# EAGLE schematic Eagle_Dued (EAGLE 6.4)
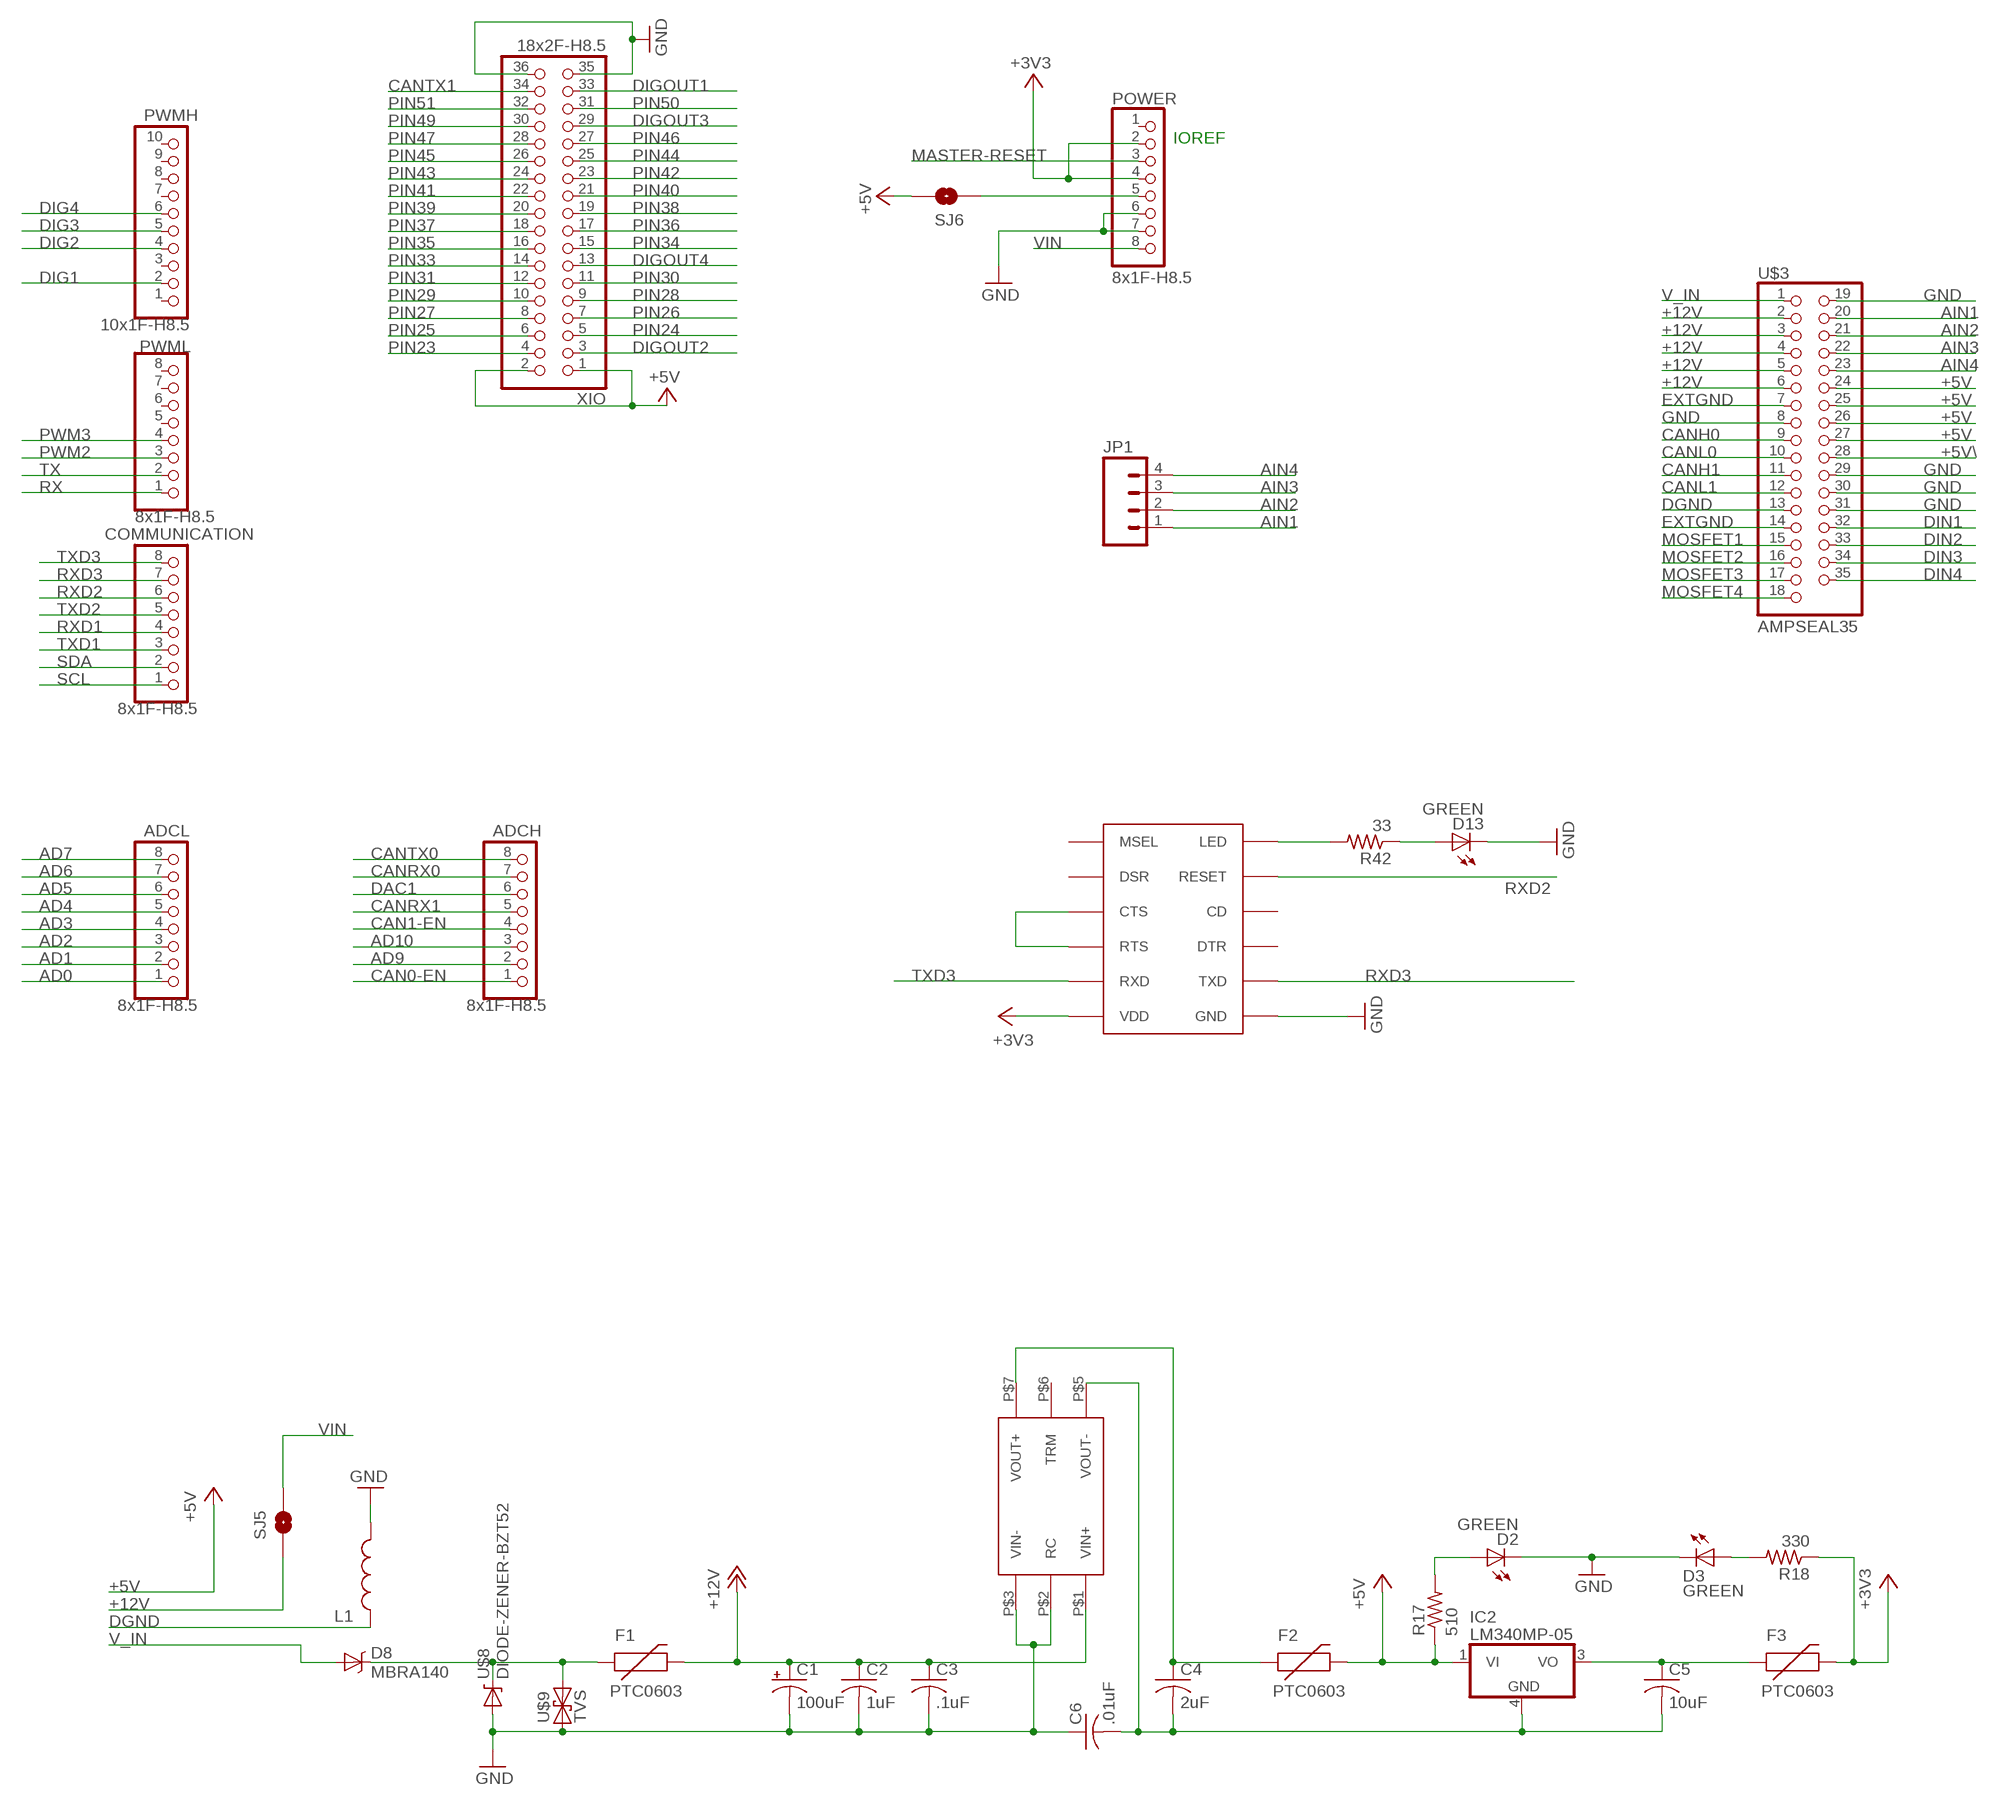
[diagram p0: schematic, sheet 1, part 1 of 2]
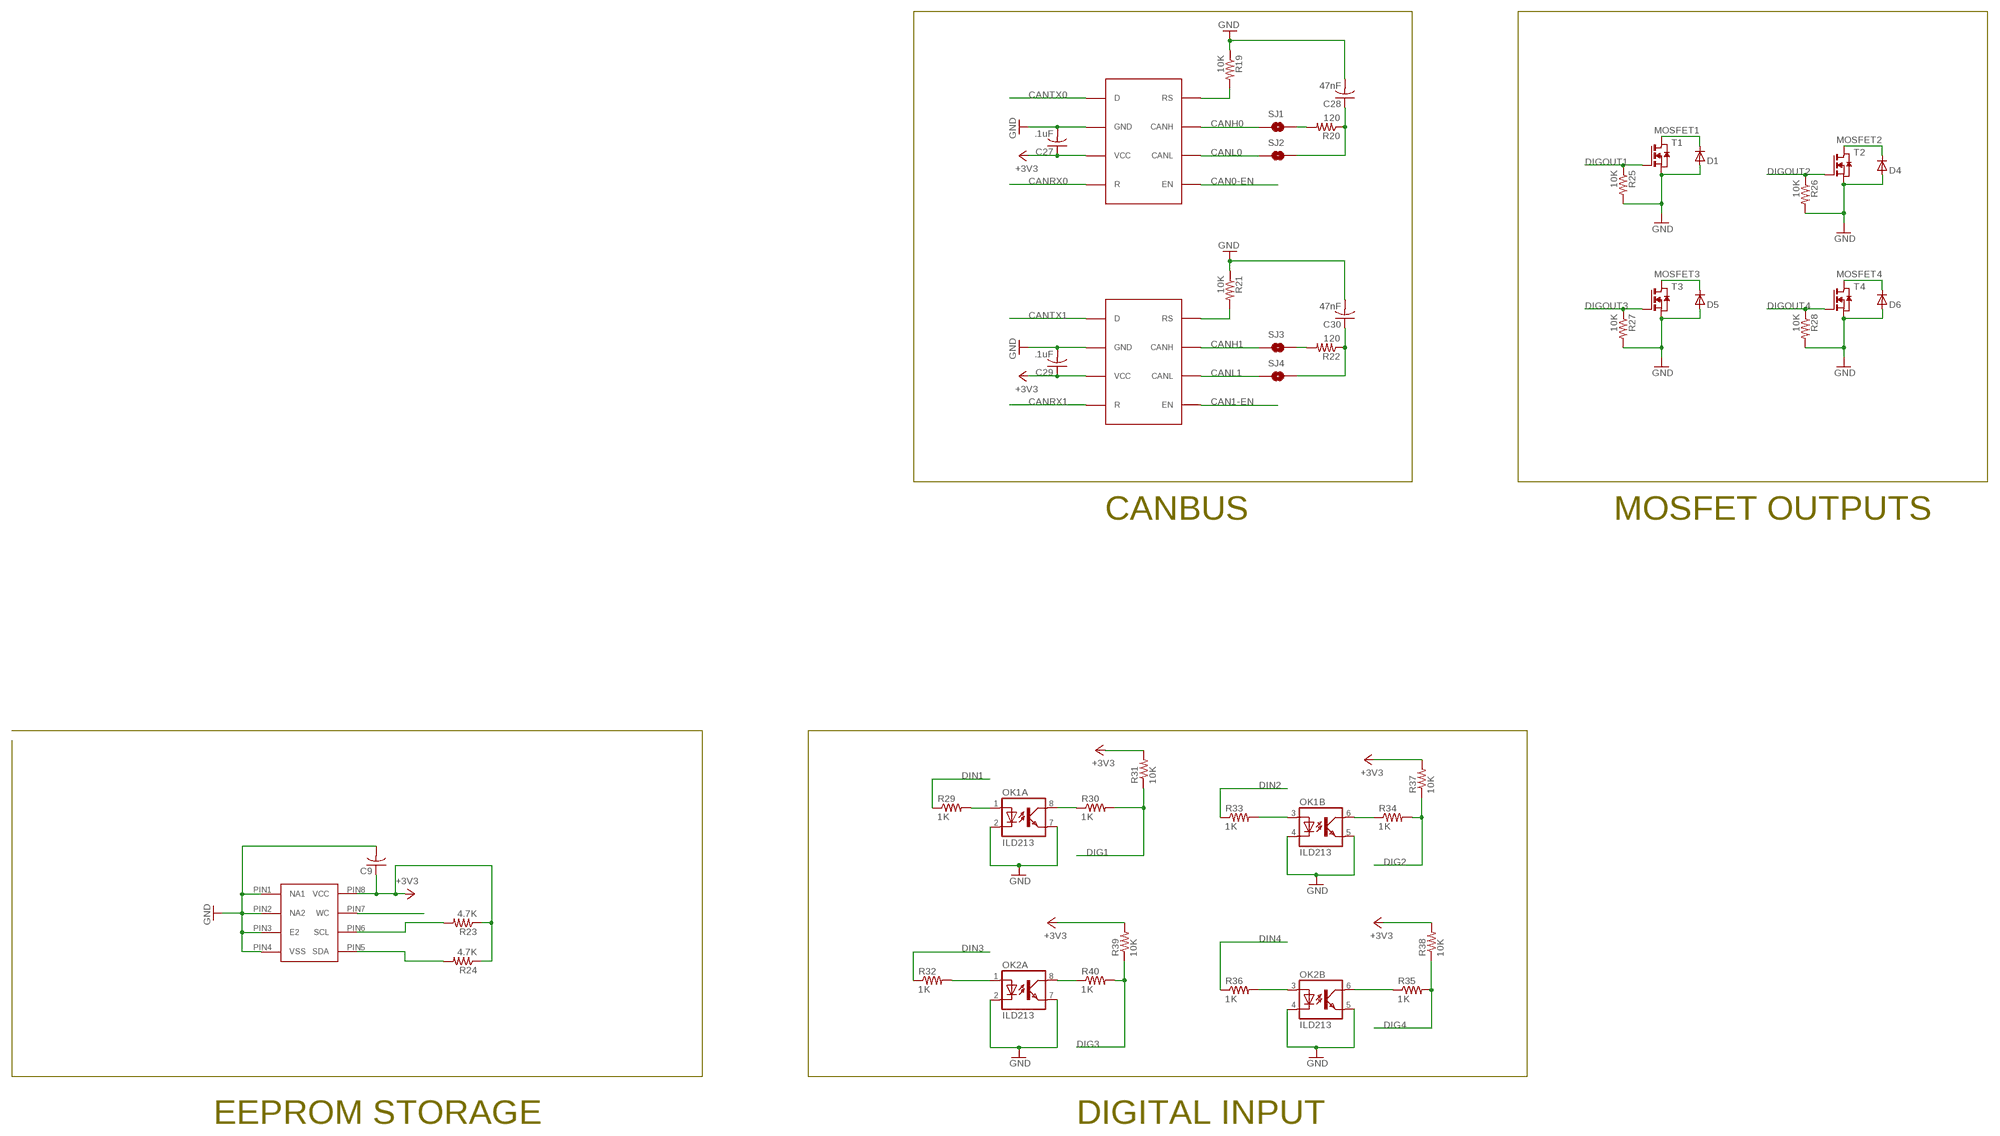
[diagram p1: schematic, sheet 1, part 2 of 2]

## Parts
ADCH  8x1F-H8.5  PINHD-1X8  [1X08]
ADCL  8x1F-H8.5  PINHD-1X8  [1X08]
C1  100uF  CPOL-USE2.5-6  [E2,5-6]
C2  1uF  C-USC1206  [C1206]
C3  .1uF  C-USC1206  [C1206]
C4  2uF  C-USC0805  [C0805]
C5  10uF  C-USC1206  [C1206]
C6  .01uF  C-USC1206  [C1206]
C9  C-USC0603  [C0603]
C27  .1uF  C-USC0603  [C0603]
C28  47nF  C-USC0603  [C0603]
C29  .1uF  C-USC0603  [C0603]
C30  47nF  C-USC0603  [C0603]
COMMUNICATION  8x1F-H8.5  PINHD-1X8  [1X08]
D1  MBR0520LT  [SOD123]
D2  GREEN  LED-GREEN0603  [LED-0603]
D3  GREEN  LED-GREEN0603  [LED-0603]
D4  MBR0520LT  [SOD123]
D5  MBR0520LT  [SOD123]
D6  MBR0520LT  [SOD123]
D8  MBRA140  [SMA-DIODE]
D13  GREEN  LED-GREEN0603  [LED-0603]
F1  PTC0603  [0603]
F2  PTC0603  [0603]
F3  PTC0603  [0603]
IC2  LM340MP-05  [SOT223]
JP1  M04POLAR  [MOLEX-1X4]
L1  INDUCTOR1206H*  [INDUCTOR-1206]
OK1  ILD213  [SOIC08]
OK2  ILD213  [SOIC08]
POWER  8x1F-H8.5  PINHD-1X8  [1X08]
PWMH  10x1F-H8.5  PINHD-1X10  [1X10]
PWML  8x1F-H8.5  PINHD-1X8  [1X08]
R17  510  R-US_R0603  [R0603]
R18  330  R-US_R0603  [R0603]
R19  10K  R-US_R0603  [R0603]
R20  120  R-US_R0603  [R0603]
R21  10K  R-US_R0603  [R0603]
R22  120  R-US_R0603  [R0603]
R23  4.7K  R-US_R0603  [R0603]
R24  4.7K  R-US_R0603  [R0603]
R25  10K  R-US_R0603  [R0603]
R26  10K  R-US_R0603  [R0603]
R27  10K  R-US_R0603  [R0603]
R28  10K  R-US_R0603  [R0603]
R29  1K  R-US_R0603  [R0603]
R30  1K  R-US_R0603  [R0603]
R31  10K  R-US_R0603  [R0603]
R32  1K  R-US_R0603  [R0603]
R33  1K  R-US_R0603  [R0603]
R34  1K  R-US_R0603  [R0603]
R35  1K  R-US_R0603  [R0603]
R36  1K  R-US_R0603  [R0603]
R37  10K  R-US_R0603  [R0603]
R38  10K  R-US_R0603  [R0603]
R39  10K  R-US_R0603  [R0603]
R40  1K  R-US_R0603  [R0603]
R42  33  R-US_R0603  [R0603]
SJ1  SOLDERJUMPERNO  [SJ_2S-NO]
SJ2  SOLDERJUMPERNO  [SJ_2S-NO]
SJ3  SOLDERJUMPERNO  [SJ_2S-NO]
SJ4  SOLDERJUMPERNO  [SJ_2S-NO]
SJ5  SOLDERJUMPERNO  [SJ_2S-NO]
SJ6  SOLDERJUMPERNO  [SJ_2S-NO]
T1  NMOSSOT223  [SOT223]
T2  NMOSSOT223  [SOT223]
T3  NMOSSOT223  [SOT223]
T4  NMOSSOT223  [SOT223]
U$1  CC3-E  [CC3-E]
U$2  SN65HVD234  [SOIC8]
U$3  AMPSEAL35  [AMPSEAL35]
U$4  MINIWIFI  [MINIWIFI]
U$5  M24M02-DRMN6TP  [SOIC8]
U$6  SN65HVD234  [SOIC8]
U$8  DIODE-ZENER-BZT52  [SOD-323]
U$9  TVS  [SMA-DIODE]
XIO  18x2F-H8.5  PINHD-2X18  [2X18]

## Nets
+3V3: C9.1 C27.1 C29.1 F3.2 POWER.2 POWER.4 R18.1 R23.1 R24.1 R31.2 R37.2 R38.2 R39.2 U$2.PIN3(VCC) U$4.P$1(VDD) U$5.PIN8(VCC) U$6.PIN3(VCC)
+5V: F2.2 IC2.1(VI) R17.1 SJ6.2 U$3.24 U$3.25 U$3.26 U$3.27 XIO.1 XIO.2
+5V\: U$3.28
+12V: C1.+ C2.1 C3.1 F1.2 SJ5.1 U$1.P$1(VIN+) U$3.2 U$3.3 U$3.4 U$3.5 U$3.6
AD0: ADCL.1
AD1: ADCL.2
AD2: ADCL.3
AD3: ADCL.4
AD4: ADCL.5
AD5: ADCL.6
AD6: ADCL.7
AD7: ADCL.8
AD9: ADCH.2
AD10: ADCH.3
AIN1: JP1.1 U$3.20
AIN2: JP1.2 U$3.21
AIN3: JP1.3 U$3.22
AIN4: JP1.4 U$3.23
CAN0-EN: ADCH.1 U$6.PIN5(EN)
CAN1-EN: ADCH.4 U$2.PIN5(EN)
CANH0: SJ1.1 U$3.9 U$6.PIN7(CANH)
CANH1: SJ3.1 U$2.PIN7(CANH) U$3.11
CANL0: SJ2.1 U$3.10 U$6.PIN6(CANL)
CANL1: SJ4.1 U$2.PIN6(CANL) U$3.12
CANRX0: ADCH.7 U$6.PIN4(R)
CANRX1: ADCH.5 U$2.PIN4(R)
CANTX0: ADCH.8 U$6.PIN1(D)
CANTX1: U$2.PIN1(D) XIO.34
DAC1: ADCH.6
DGND: L1.P$1 U$3.13
DIG1: PWMH.2 R30.2 R31.1
DIG2: PWMH.4 R34.2 R37.1
DIG3: PWMH.5 R39.1 R40.2
DIG4: PWMH.6 R35.2 R38.1
DIGOUT1: R25.1 T1.1(G) XIO.33
DIGOUT2: R26.1 T2.1(G) XIO.3
DIGOUT3: R27.1 T3.1(G) XIO.29
DIGOUT4: R28.1 T4.1(G) XIO.13
DIN1: R29.1 U$3.32
DIN2: R33.1 U$3.33
DIN3: R32.1 U$3.34
DIN4: R36.1 U$3.35
EXTGND: C1.- C2.2 C3.2 C6.1 D1.A D4.A D5.A D6.A OK1.2(A:C) OK1.4(B:C) OK1.5(B:EMIT) OK1.7(A:EMIT) OK2.2(A:C) OK2.4(B:C) OK2.5(B:EMIT) OK2.7(A:EMIT) R25.2 R26.2 R27.2 R28.2 T1.3(S) T2.3(S) T3.3(S) T4.3(S) U$1.P$2(RC) U$1.P$3(VIN-) U$3.7 U$3.14 U$8.2(A) U$9.A ; supply symbol labelled GND
GND: C4.2 C5.2 C6.2 C9.2 C27.2 C28.2 C29.2 C30.2 D2.C D3.C D13.C IC2.4(GND) L1.P$2 POWER.6 POWER.7 R19.1 R21.1 U$1.P$5(VOUT-) U$2.PIN2(GND) U$3.8 U$3.19 U$3.29 U$3.30 U$3.31 U$4.P$2(GND) U$5.PIN1(NA1) U$5.PIN2(NA2) U$5.PIN3(E2) U$5.PIN4(VSS) U$6.PIN2(GND) XIO.35 XIO.36
MASTER-RESET: POWER.3
MOSFET1: D1.C T1.2(D) T1.4(D) U$3.15
MOSFET2: D4.C T2.2(D) T2.4(D) U$3.16
MOSFET3: D5.C T3.2(D) T3.4(D) U$3.17
MOSFET4: D6.C T4.2(D) T4.4(D) U$3.18
N$1: POWER.5 SJ6.1
N$2: U$4.P$5(RTS) U$4.P$7(CTS)
N$3: D8.C F1.1 U$8.1(C) U$9.C
N$4: R42.2 U$4.P$12(LED)
N$6: C4.1 F2.1 U$1.P$7(VOUT+)
N$8: C5.1 F3.1 IC2.3(VO)
N$9: D13.A R42.1
N$23: D2.A R17.2
N$24: R19.2 U$6.PIN8(RS)
N$25: D3.A R18.2
N$26: C28.1 R20.1 SJ2.2
N$27: R20.2 SJ1.2
N$28: R21.2 U$2.PIN8(RS)
N$29: C30.1 R22.1 SJ4.2
N$30: R22.2 SJ3.2
N$31: OK1.1(A:A) R29.2
N$32: OK1.3(B:A) R33.2
N$33: OK1.8(A:COL) R30.1
N$34: OK1.6(B:COL) R34.1
N$36: OK2.6(B:COL) R35.1
N$38: OK2.8(A:COL) R40.1
N$40: OK2.1(A:A) R32.2
N$43: OK2.3(B:A) R36.2
PIN23: XIO.4
PIN24: XIO.5
PIN25: XIO.6
PIN26: XIO.7
PIN27: XIO.8
PIN28: XIO.9
PIN29: XIO.10
PIN30: XIO.11
PIN31: XIO.12
PIN33: XIO.14
PIN34: XIO.15
PIN35: XIO.16
PIN36: XIO.17
PIN37: XIO.18
PIN38: XIO.19
PIN39: XIO.20
PIN40: XIO.21
PIN41: XIO.22
PIN42: XIO.23
PIN43: XIO.24
PIN44: XIO.25
PIN45: XIO.26
PIN46: XIO.27
PIN47: XIO.28
PIN49: XIO.30
PIN50: XIO.31
PIN51: XIO.32
PWM2: PWML.3
PWM3: PWML.4
RX: PWML.1
RXD1: COMMUNICATION.4 U$5.PIN7(WC)
RXD2: COMMUNICATION.6 U$4.P$10(RESET)
RXD3: COMMUNICATION.7 U$4.P$4(TXD)
SCL: COMMUNICATION.1 R23.2 U$5.PIN6(SCL)
SDA: COMMUNICATION.2 R24.2 U$5.PIN5(SDA)
TX: PWML.2
TXD1: COMMUNICATION.3
TXD2: COMMUNICATION.5
TXD3: COMMUNICATION.8 U$4.P$3(RXD)
V_IN: D8.A U$3.1
VIN: POWER.8 SJ5.2
Unconnected: POWER.1 PWMH.1 PWMH.3 PWMH.7 PWMH.8 PWMH.9 PWMH.10 PWML.5 PWML.6 PWML.7 PWML.8 U$1.P$6(TRM) U$4.P$6(DTR) U$4.P$8(CD) U$4.P$9(DSR) U$4.P$11(MSEL)

## Notes on the sheet
- IOREF
- CANBUS | MOSFET OUTPUTS
- EEPROM STORAGE | DIGITAL INPUT

## Library data of the parts
ADCH ADCL COMMUNICATION POWER PWML = SmartPrj:PINHD-1X8: PIN HEADER
C1 = rcl:CPOL-US: POLARIZED CAPACITOR, American symbol
C2-C6 C9 C27-C30 = rcl:C-US: CAPACITOR, American symbol
D1 D4-D6 = diode:MBR0520LT: SCHOTTKY BARRIER RECTIFIER Source: http://onsemi.com .. MBR0520LT1-D.pdf
D2 D3 D13 = SparkFun-LED:LED-GREEN: Various green LEDs 0603- DIO-00821 LARGE- DIO-00862 LILYPAD- DIO-09910; PROD_ID: DIO-00821
D8 = SparkFun-DiscreteSemi:MBRA140: 40V, 1A Schottky rectifier SMA/DO-214AC package DIO-08053; PROD_ID: DIO-08053
F1-F3 = SparkFun-PowerIC:PTC: Resettable Fuse PTC Resettable Fuse. Spark Fun Electronics SKU : COM-08357
IC2 = linear:LM340?-*: Positive VOLTAGE REGULATOR Source: http://cache.national.com/ds/LM/LM340.pdf
JP1 = SparkFun-Connectors:M04: Header 4 Standard 4-pin 0.1" header. Use with straight break away headers (SKU : PRT-00116), right angle break away headers (PRT-00553), swiss pins (PRT-00743), machine pins (PRT-00117), and female headers (PRT-00115). Molex polarized connector foot print use with SKU : PRT-08231 with associated crimp pins and housings. 1MM SMD Version SKU: PRT-10208
L1 = SparkFun-Passives:INDUCTOR: Inductors Basic Inductor/Choke - 0603 and 1206. Footprints are not proven and vary greatly between part numbers.
OK1 OK2 = optocoupler:ILD2*: Siemens ILD205/206/207/211/213/217 DUAL PHOTOTRANSISTOR SMALL OUTLINE SURFACE MOUNT OPTOCOUPLER Source: 153385-da-01-en-Optocoupler_ILD205-T.pdf; MF: VISHAY/TELEFUNKEN; MPN: ILD213T; OC_FARNELL: 1045451; OC_NEWARK: 20H8680
PWMH = SmartPrj:PINHD-1X10: PIN HEADER
R17-R40 R42 = rcl:R-US_: RESISTOR, American symbol
SJ1-SJ6 = SparkFun-Passives:SOLDERJUMPER: Solder Jumper Standard SMD solder jumper. Used to automate production. Two varients : Normally Open and Normally Closed are the same, but have different paste layers. NC will have a large amount of paste and should jumper during reflow.
T1-T4 = zetex:NMOSSOT223: MOS FET; OC_FARNELL: unknown; OC_NEWARK: unknown
U$1 = dc-dc-converter:CC3-E
U$2 U$6 = ck_custom:SN65HVD234
U$3 = Ampseal:AMPSEAL35: Ampseal 35 pin PCB mount
U$4 = ck_custom:MINIWIFI
U$5 = ck_custom:M24M02-DRMN6TP
U$8 = SparkFun-DiscreteSemi:DIODE-ZENER: Zener Diode Production Part - 8199 3.4V Zener Voltage
U$9 = SparkFun-DiscreteSemi:TVS: Transient voltage suppressor- prevents ESD on inputs. Ignore package description- MBRA140 is NOT this type of part!!!
XIO = SmartPrj:PINHD-2X18: PIN HEADER

## Net classes
0 default: width 0.203 mm, drill 0.305 mm, clearance 0.203 mm
1 USB: drill 0.406 mm, clearance 0.203 mm to class 0, clearance 0.406 mm
2 gnd: width 0.305 mm, drill 0.406 mm, clearance 0.203 mm to class 0, clearance 0.203 mm
3 usbvcc: width 0.61 mm, drill 0.508 mm, clearance 0.203 mm to class 0, clearance 0.254 mm